# Altium schematic sheet 1019.SCHDOC
size A4
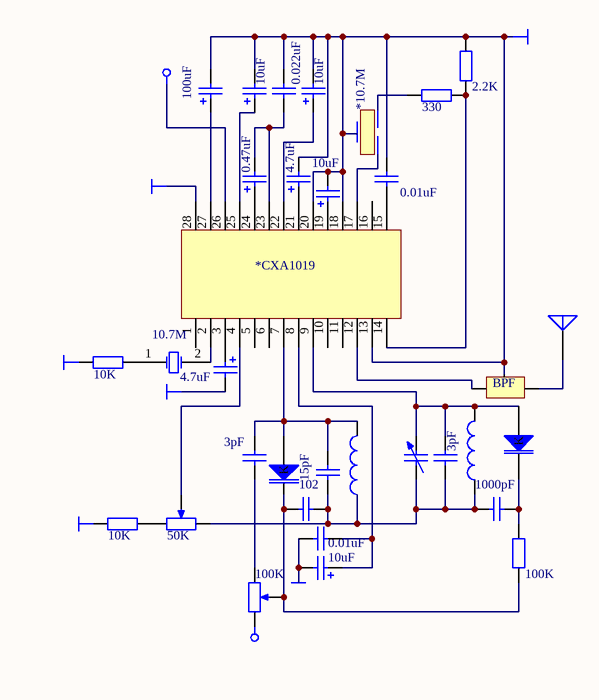
[diagram p0: 1019.SCHDOC]

## Parts
(Parts that share a designator on the sheet are numbered #1, #2 ... from top to bottom, then left to right.)
10.7M  XTAL  [BCY-W2/D3.1]  (value not drawn)
*  Component_1  (value not drawn)
*10.7M  Component_1  (value not drawn)
*CXA1019  Component_1  [DIP-28]  (value not drawn)
C?#1  value 100uF  [RB7.6-15]  (hidden comment: Cap Pol1)
C?#2  value 10uF  [RB7.6-15]  (hidden comment: Cap Pol1)
C?#3  value 0.022uF  [RAD-0.3]  (hidden comment: Cap)
C?#4  value 10uF  [RB7.6-15]  (hidden comment: Cap Pol1)
C?#5  value 0.47uF  [RB7.6-15]  (hidden comment: Cap Pol1)
C?#6  value 4.7uF  [RB7.6-15]  (hidden comment: Cap Pol1)
C?#7  value 0.01uF  [RAD-0.3]  (hidden comment: Cap)
C?#8  value 10uF  [RB7.6-15]  (hidden comment: Cap Pol1)
C?#9  value 4.7uF  [POLAR0.8]  (hidden comment: Cap Pol2)
C?#10  value 3pF  [RAD-0.3]  (hidden comment: Cap)
C?#11  Cap Var  [C3225-1210]  (value not drawn)
C?#12  value 3pF  [RAD-0.3]  (hidden comment: Cap)
C?#13  value 15pF  [RAD-0.3]  (hidden comment: Cap)
C?#14  value 102  [RAD-0.3]  (hidden comment: Cap)
C?#15  value 0.01uF  [RAD-0.3]  (hidden comment: Cap)
C?#16  value 1000pF  [RAD-0.3]  (hidden comment: Cap)
C?#17  value 10uF  [POLAR0.8]  (hidden comment: Cap Pol2)
D?#1  D Varactor  [SO-G3/Z3.3]  (value not drawn)
D?#2  D Varactor  [SO-G3/Z3.3]  (value not drawn)
E?  Antenna  [PIN1]  (value not drawn)
L?#1  Inductor  [C1005-0402]  (value not drawn)
L?#2  Inductor  [C1005-0402]  (value not drawn)
R?#1  value 330  [AXIAL-0.4]  (hidden comment: Res2)
R?#2  value 2.2K  [AXIAL-0.4]  (hidden comment: Res2)
R?#3  value 10K  [AXIAL-0.4]  (hidden comment: Res2)
R?#4  value 10K  [AXIAL-0.4]  (hidden comment: Res2)
R?#5  value 50K  [VR2]  (hidden comment: RPot2)
R?#6  value 100K  [AXIAL-0.4]  (hidden comment: Res2)
R?#7  value 100K  [VR2]  (hidden comment: RPot2)

## Nets
GND: C?#1.2 C?#2.2 C?#3.2 C?#4.2 C?#6.2 C?#7.2 C?#8.2 C?#9.2 C?#15.1 C?#17.2 R?#2.2 R?#3.1 R?#4.1
VCC: R?#7.1(TOP)
Net10.7M_1: 10.7M.1(OSC1) R?#3.2
NetC?#3_1: C?#3.1 C?#5.2
NetC?#10_1: C?#10.1 R?#7.2(BOT)
NetC?#10_2: C?#10.2 C?#13.2 D?#2.3(A) L?#2.2
NetC?#11_1: C?#11.1 C?#12.1 C?#13.1 C?#14.2 C?#16.2 L?#1.1 L?#2.1 R?#5.1(TOP)
NetC?#11_2: C?#11.2 C?#12.2 D?#1.3(A) L?#1.2
NetC?#14_1: C?#14.1 D?#2.1(K) R?#6.1 R?#7.3(TAP)
NetC?#15_2: C?#15.2 C?#17.1
NetC?#16_1: C?#16.1 D?#1.1(K) R?#6.2
NetR?#1_2: R?#1.2 R?#2.1
NetR?#4_2: R?#4.2 R?#5.2(BOT)

Not connected (* = marked no-connect by the designer): 10.7M 2(OSC2); * 29 30 31; *CXA1019 1 2 3 4 5 6 7 8 9 10 11 12 13 14 15 16 17 18 19 20 21 22 23 24 25 26 27 28; C?#1 1; C?#2 1; C?#4 1; C?#5 1; C?#6 1; C?#7 1; C?#8 1; C?#9 1; E? 1(A); R?#1 1; R?#5 3(TAP)

## Notes on the sheet
- (in symbol Component_1) BPF

## Library data of the parts
10.7M = XTAL: Crystal Oscillator; Manufacturer: Generic Components; Published: 08/06/2000; Publisher: Altium Hobart Technology Centre; Class: Oscillator; SubClass: Crystal Oscillator
C?#1 C?#2 C?#4-C?#6 C?#8 = Cap Pol1: Polarized Capacitor (Radial); Manufacturer: Generic Components; Class: Passive; Published: 08/06/2000; Publisher: Altium Hobart Technology Centre; SubClass: Capacitor
C?#3 C?#7 C?#10 C?#12-C?#16 = Cap: Capacitor; Manufacturer: Generic Components; Class: Passive; Published: 08/06/2000; Publisher: Altium Hobart Technology Centre; SubClass: Capacitor
C?#9 C?#17 = Cap Pol2: Polarized Capacitor (Axial); Manufacturer: Generic Components; Class: Passive; Published: 08/06/2000; Publisher: Altium Hobart Technology Centre; SubClass: Capacitor
C?#11 = Cap Var: Variable or Adjustable Capacitor; Manufacturer: Generic Components; Class: Passive; Value: 100pF; Published: 1999; SubClass: Capacitor
D?#1 D?#2 = D Varactor: Variable Capacitance Diode; Manufacturer: Generic Components; Class: Discrete; SubClass: Diode - Varactor; Note: Pin 2 is not connected and not drawn; Published: 08/06/2000
E? = Antenna: Generic Antenna; Manufacturer: Generic Components; Published: 1999
L?#1 L?#2 = Inductor: Manufacturer: Generic Components; Class: Passive; Value: 10mH; Published: 08/06/2000; Publisher: Altium Hobart Technology Centre; SubClass: Inductor
R?#1-R?#4 R?#6 = Res2: Resistor; Manufacturer: Generic Components; Class: Passive; Published: 08/06/2000; Publisher: Altium Hobart Technology Centre; SubClass: Resistor
R?#5 R?#7 = RPot2: Potentiometer; Manufacturer: Generic Components; Class: Passive; Set Position: 0.5; Published: 08/06/2000; Publisher: Altium Hobart Technology Centre; SubClass: Potentiometer